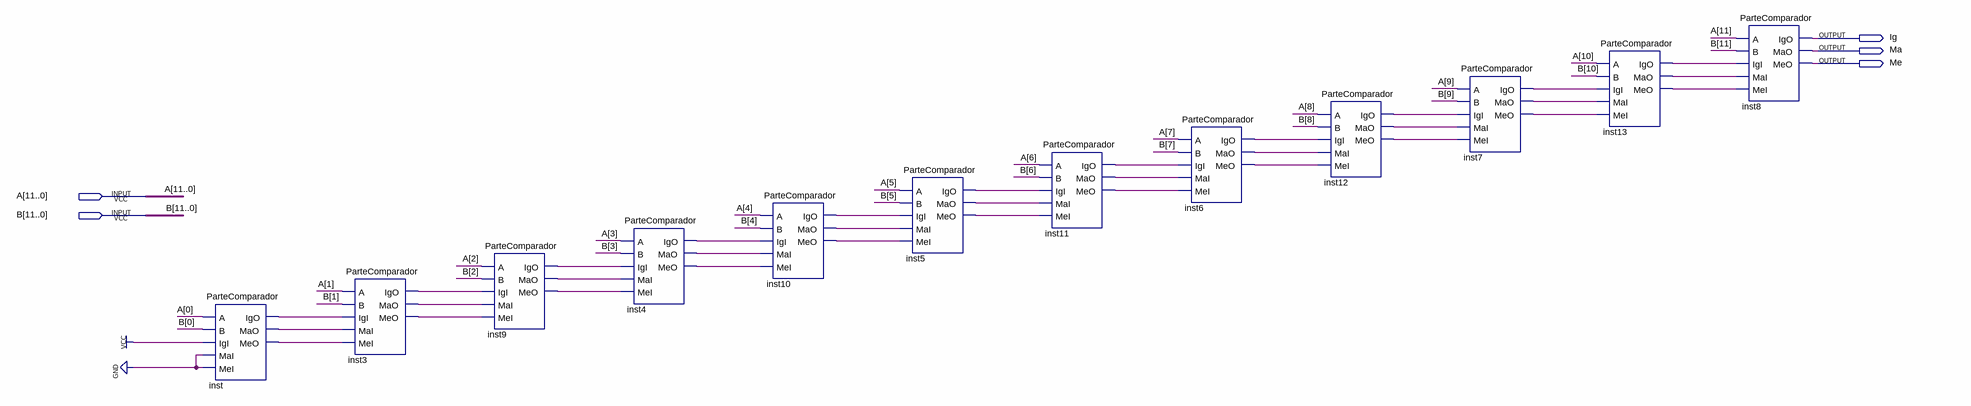
[diagram p0: schematic sheet]
// Quartus schematic Comparador.bdf as structural Verilog: 12 symbols, 5 pins
module Comparador (
  input  [11:0] A,
  input  [11:0] B,
  output Ig,
  output Ma,
  output Me
);

  wire inst3_igo, inst3_mao, inst3_meo, inst4_igo, inst4_mao, inst4_meo, inst5_igo, inst5_mao, inst5_meo,
       inst6_igo, inst6_mao, inst6_meo, inst7_igo, inst7_mao, inst7_meo, inst9_igo, inst9_mao, inst9_meo,
       inst10_igo, inst10_mao, inst10_meo, inst11_igo, inst11_mao, inst11_meo, inst12_igo, inst12_mao,
       inst12_meo, inst13_igo, inst13_mao, inst13_meo, inst_igo, inst_mao, inst_meo;

  ParteComparador inst (
    .A(A[0]), .B(B[0]), .MaI(1'b0), .MeI(1'b0), .IgI(1'b1), .IgO(inst_igo), .MaO(inst_mao), .MeO(inst_meo));
  ParteComparador inst3 (
    .A(A[1]), .B(B[1]), .MaI(inst_mao), .MeI(inst_meo), .IgI(inst_igo), .IgO(inst3_igo), .MaO(inst3_mao),
    .MeO(inst3_meo));
  ParteComparador inst9 (
    .A(A[2]), .B(B[2]), .MaI(inst3_mao), .MeI(inst3_meo), .IgI(inst3_igo), .IgO(inst9_igo), .MaO(inst9_mao),
    .MeO(inst9_meo));
  ParteComparador inst4 (
    .A(A[3]), .B(B[3]), .MaI(inst9_mao), .MeI(inst9_meo), .IgI(inst9_igo), .IgO(inst4_igo), .MaO(inst4_mao),
    .MeO(inst4_meo));
  ParteComparador inst10 (
    .A(A[4]), .B(B[4]), .MaI(inst4_mao), .MeI(inst4_meo), .IgI(inst4_igo), .IgO(inst10_igo),
    .MaO(inst10_mao), .MeO(inst10_meo));
  ParteComparador inst5 (
    .A(A[5]), .B(B[5]), .MaI(inst10_mao), .MeI(inst10_meo), .IgI(inst10_igo), .IgO(inst5_igo),
    .MaO(inst5_mao), .MeO(inst5_meo));
  ParteComparador inst11 (
    .A(A[6]), .B(B[6]), .MaI(inst5_mao), .MeI(inst5_meo), .IgI(inst5_igo), .IgO(inst11_igo),
    .MaO(inst11_mao), .MeO(inst11_meo));
  ParteComparador inst6 (
    .A(A[7]), .B(B[7]), .MaI(inst11_mao), .MeI(inst11_meo), .IgI(inst11_igo), .IgO(inst6_igo),
    .MaO(inst6_mao), .MeO(inst6_meo));
  ParteComparador inst12 (
    .A(A[8]), .B(B[8]), .MaI(inst6_mao), .MeI(inst6_meo), .IgI(inst6_igo), .IgO(inst12_igo),
    .MaO(inst12_mao), .MeO(inst12_meo));
  ParteComparador inst7 (
    .A(A[9]), .B(B[9]), .MaI(inst12_mao), .MeI(inst12_meo), .IgI(inst12_igo), .IgO(inst7_igo),
    .MaO(inst7_mao), .MeO(inst7_meo));
  ParteComparador inst13 (
    .A(A[10]), .B(B[10]), .MaI(inst7_mao), .MeI(inst7_meo), .IgI(inst7_igo), .IgO(inst13_igo),
    .MaO(inst13_mao), .MeO(inst13_meo));
  ParteComparador inst8 (
    .A(A[11]), .B(B[11]), .MaI(inst13_mao), .MeI(inst13_meo), .IgI(inst13_igo), .IgO(Ig), .MaO(Ma), .MeO(Me));
endmodule
